# EAGLE design FT232-Breakout-v1 (EAGLE 6.4)
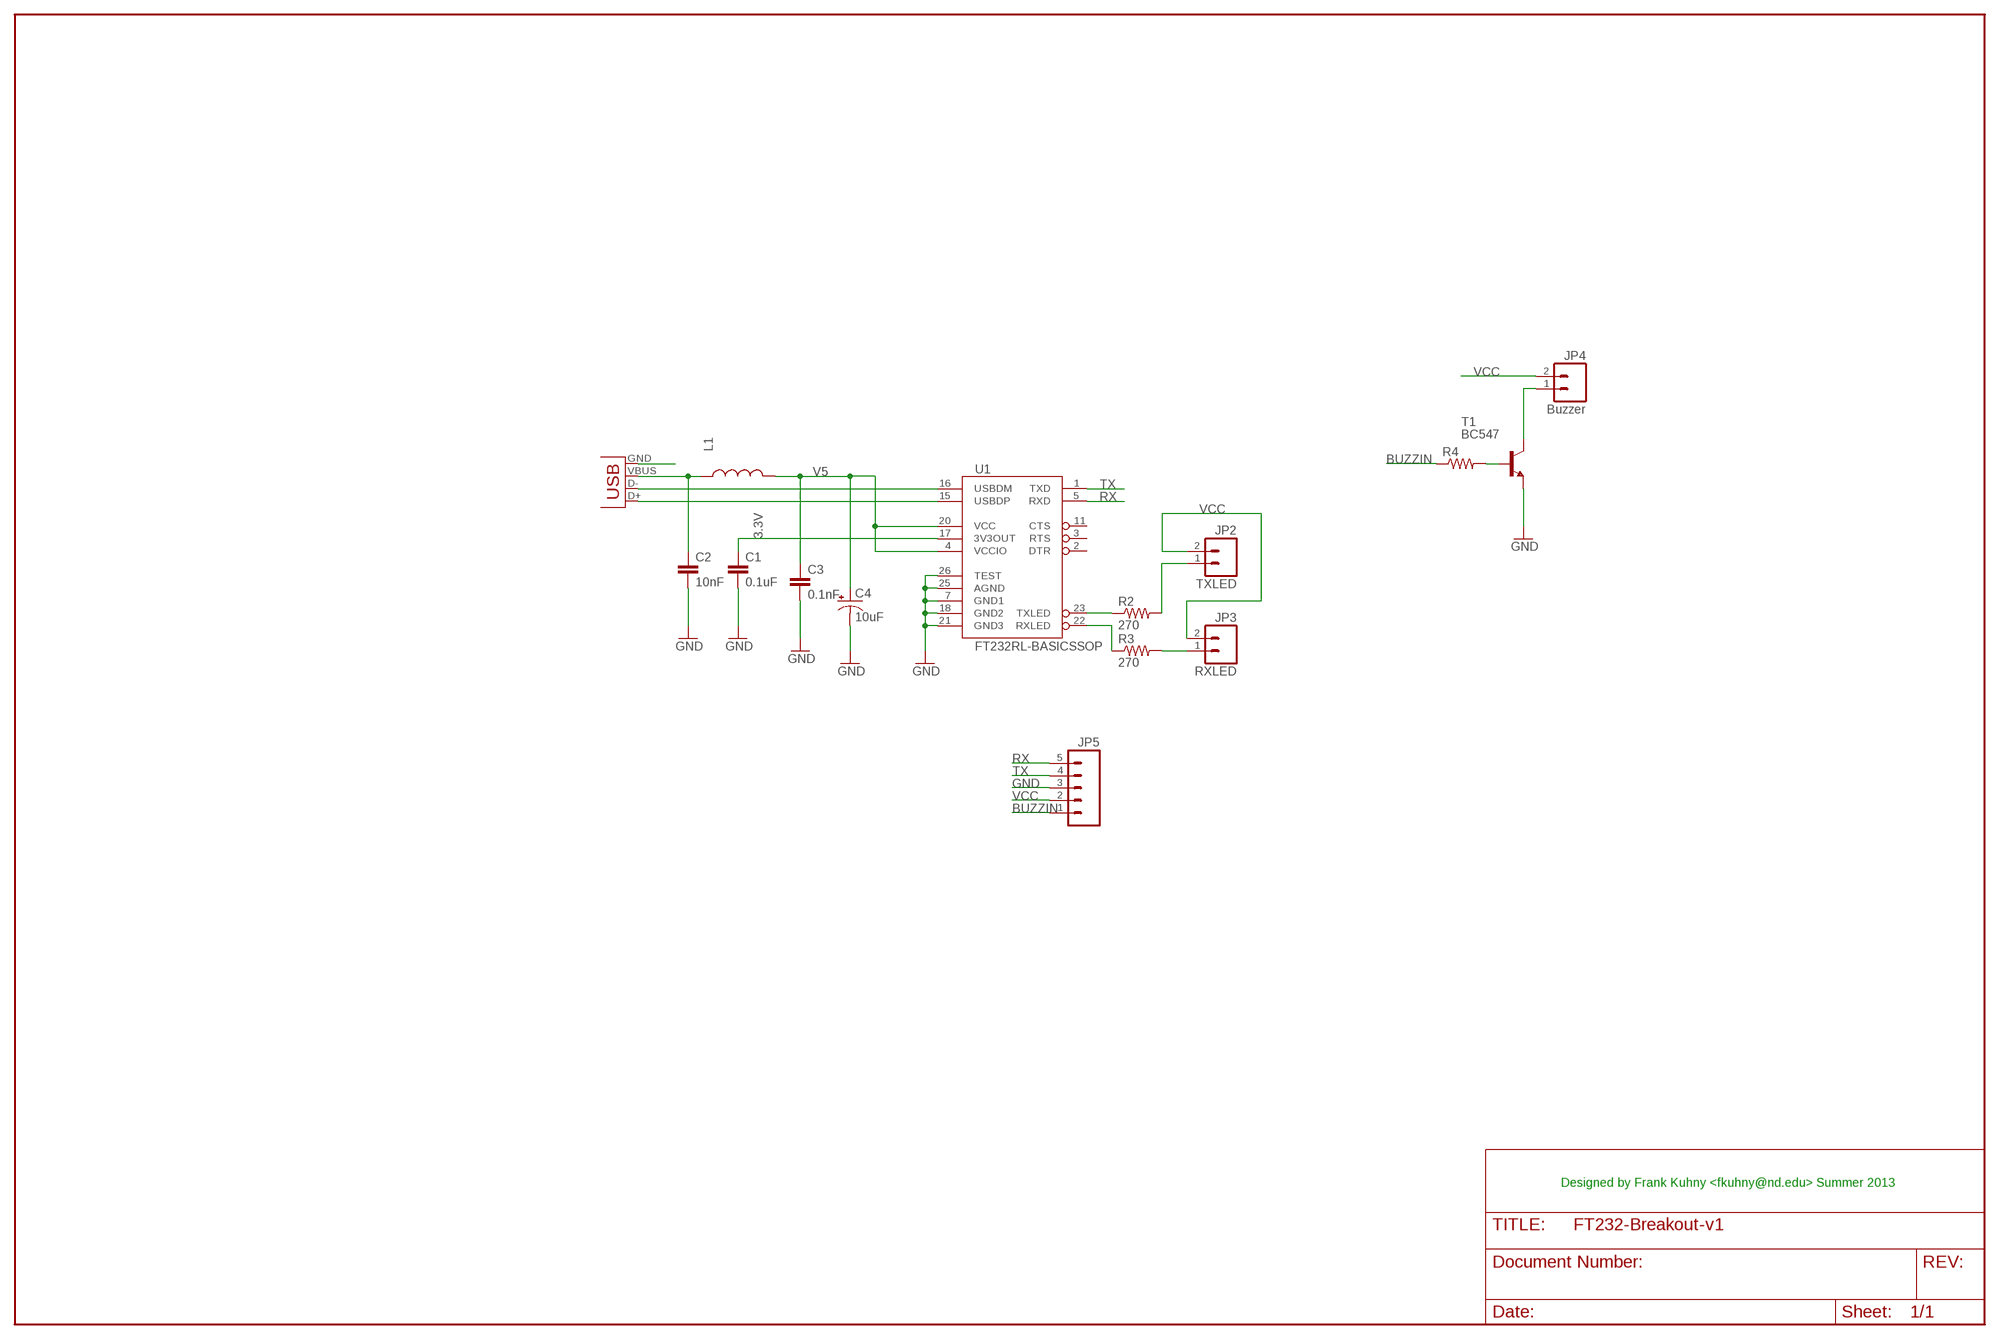
[diagram p0: schematic, sheet 1]

## Parts
C1  0.1uF  .22UF-CER  [0402-CAP]
C2  10nF  .22UF-CER  [0402-CAP]
C3  0.1nF  .22UF-CER  [0402-CAP]
C4  10uF  10UF-TANT  [EIA3216]
JP1  USB-B  USBPTH  [USB-B-PTH]
JP2  TXLED  M02LOCK  [1X02_LOCK]
JP3  RXLED  M02LOCK  [1X02_LOCK]
JP4  Buzzer  M02LOCK  [1X02_LOCK]
JP5  M05LOCK  [1X05_LOCK]
L1  INDUCTOR0603  [0603]
R2  270  RESISTORPTH-1/2W  [AXIAL-0.5]
R3  270  RESISTORPTH-1/2W  [AXIAL-0.5]
R4  RESISTORPTH-1/2W  [AXIAL-0.5]
T1  BC547  [TO92]
U1  FT232RL-BASICSSOP  [SSOP28DB]

## Nets
3.3V: C1.1 U1.17(3V3OUT)
BUZZIN: JP5.1 R4.P$1
GND: C1.2 C2.2 C3.2 C4.C(-) JP1.GND JP5.3 T1.1(E) U1.7(GND1) U1.18(GND2) U1.21(GND3) U1.25(AGND) U1.26(TEST)
N$1: C2.1 JP1.VBUS L1.1
N$2: R4.P$2 T1.2(B)
N$3: JP3.1 R3.P$2
N$4: JP1.D- U1.16(USBDM)
N$5: JP1.D+ U1.15(USBDP)
N$6: JP4.1 T1.3(C)
N$7: R3.P$1 U1.22(RXLED)
N$8: R2.P$1 U1.23(TXLED)
N$9: JP2.1 R2.P$2
RX: JP5.5 U1.5(RXD)
TX: JP5.4 U1.1(TXD)
V5: C3.1 C4.A(+) L1.2 U1.4(VCCIO) U1.20(VCC)
VCC: JP2.2 JP3.2 JP4.2 JP5.2
Unconnected: U1.2(DTR) U1.3(RTS) U1.11(CTS)

## Notes on the sheet
- Designed by Frank Kuhny <fkuhny@nd.edu> Summer 2013

## Library data of the parts
C1-C3 = SparkFun-Capacitors:.22UF-CER: .22uF ceramic SMT CAP-09885- 50V +80%/-20% (0603); PROD_ID: CAP-09885; VALUE: .22uF
C4 = SparkFun-Capacitors:10UF-TANT: 10uF Tantalum SMT CAP-00811- 16V 10% (EIA-3216); PROD_ID: CAP-00811
JP1 = SparkFun-Connectors:USB: USB Connectors USB-B-PTH is fully proven SKU : PRT-00139/CONN-08278 USB-miniB is fully proven SKU : PRT-00587 USB-A-PCB is untested. USB-A-H is throughly reviewed, but untested. Spark Fun Electronics SKU : PRT-00437 USB-B-SMT is throughly reviewed, but untested. Needs silkscreen touching up. USB-A-S has not been used/tested USB-MB-H has not been used/tested USB-MICROB has been used. CONN-09505; PROD_ID: CONN-08278
JP2-JP4 = SparkFun-Connectors:M02: Standard 2-pin 0.1" header. Use with - straight break away headers ( PRT-00116) - right angle break away headers (PRT-00553) - swiss pins (PRT-00743) - machine pins (PRT-00117) - female headers (PRT-00115) Molex polarized connector foot print use with: PRT-08233 with associated crimp pins and housings. 2.54_SCREWTERM for use with PRT-10571. 3.5mm Screw Terminal footprints for PRT-08084 5mm Screw Terminal footprints for use with PRT-08433
JP5 = SparkFun-Connectors:M05: Header 5 Standard 5-pin 0.1" header. Use with straight break away headers (SKU : PRT-00116), right angle break away headers (PRT-00553), swiss pins (PRT-00743), machine pins (PRT-00117), and female headers (PRT-00115). Molex polarized connector foot print use with SKU : PRT-08230 with associated crimp pins and housings.
L1 = SparkFun-Passives:INDUCTOR: Inductors Basic Inductor/Choke - 0603 and 1206. Footprints are not proven and vary greatly between part numbers. SRN6045- 33uH, 20% 1.4A
R2-R4 = SparkFun-Passives:RESISTOR: Resistor Basic schematic elements and footprints for 0603, 1206, and PTH resistors.
T1 = transistor:BC547: NPN TRANSISTOR
U1 = SparkFun-DigitalIC:FT232RL-BASIC: USB UART This is the simplified version of the FT232RL unit. Only what you need, nothing you don't. Spark Fun Electronics SKU : COM-00650

## Board
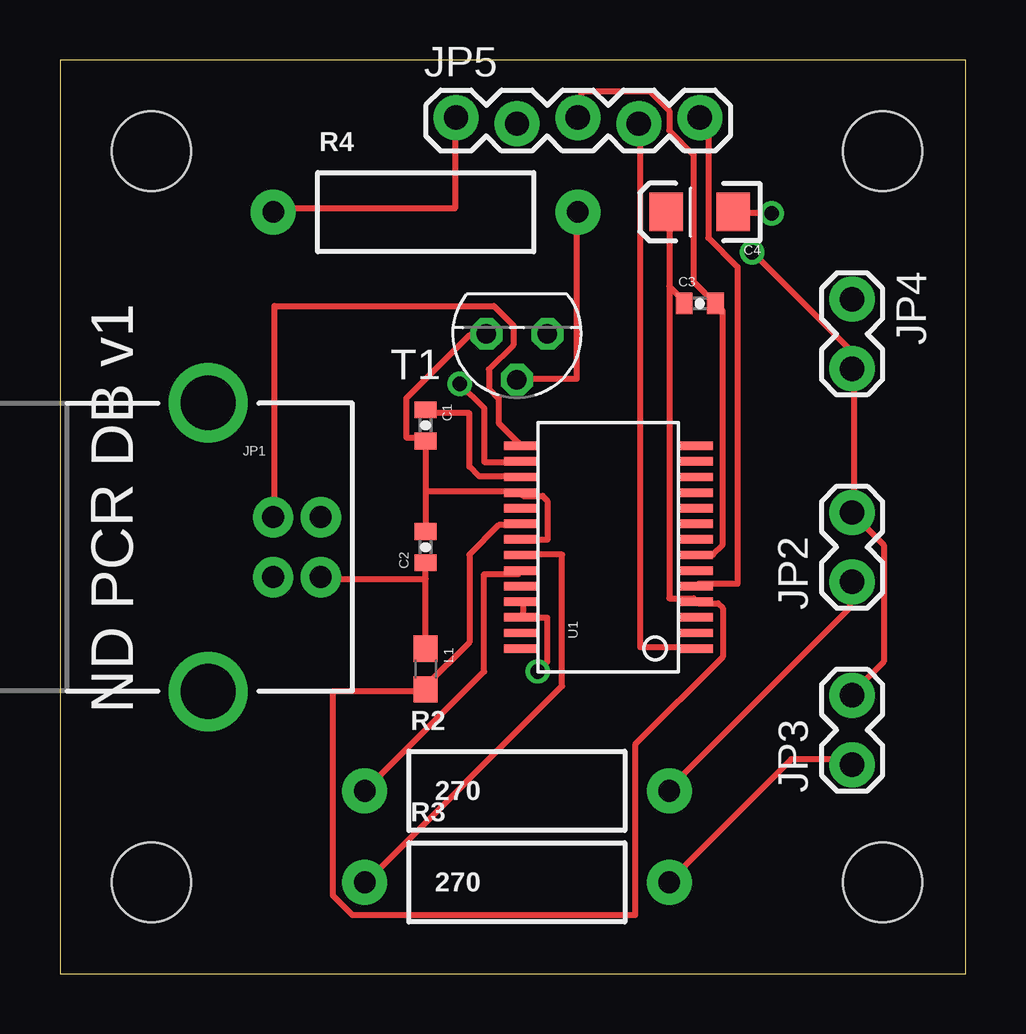
[diagram p1: board, top side]
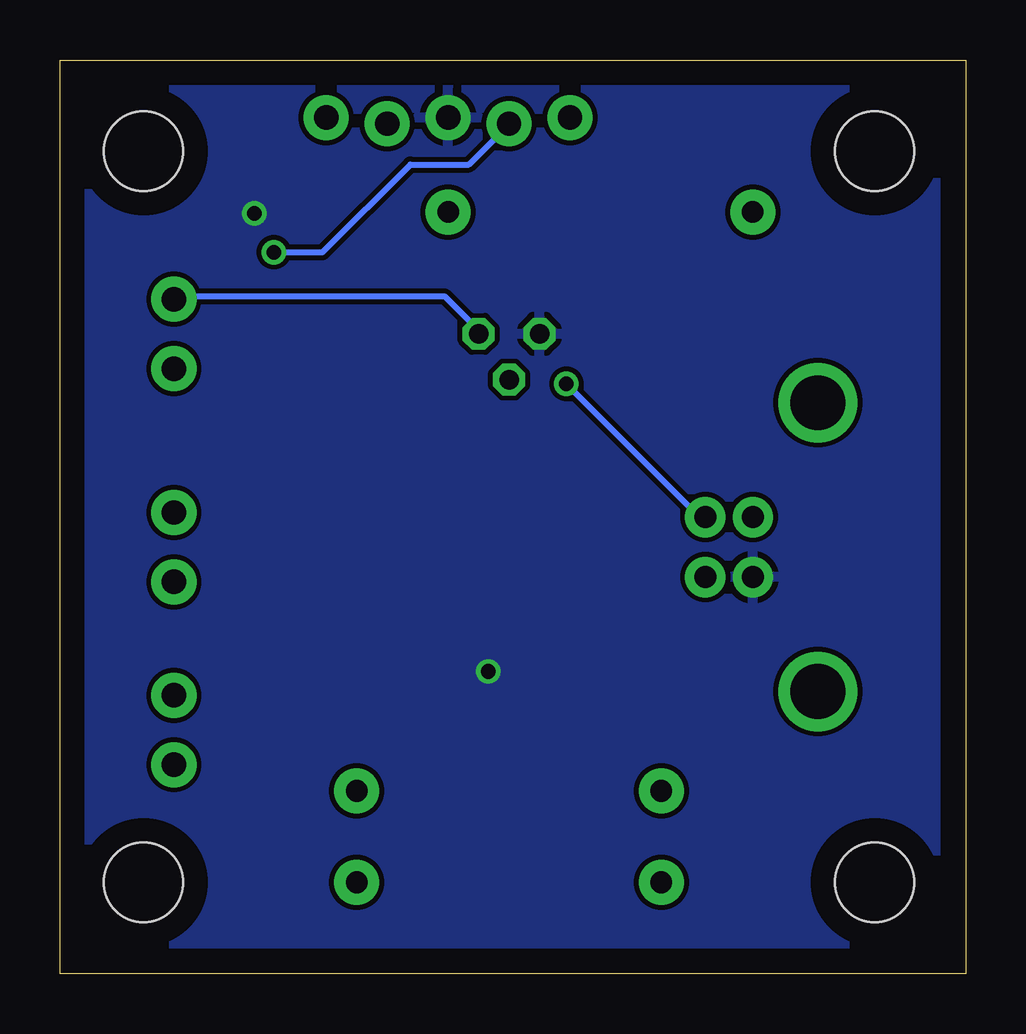
[diagram p2: board, bottom side, seen from below]

Size 37.77 x 38.09 mm. Coordinates in mm from the lower left corner, seen from the top.
Outline: 0,0 37.77,0 37.77,38.09 0,38.09 0,0
Copper layers (1*16): Top 0.035mm / dielectric 1.5mm / Bottom 0.035mm
Design rules "default": minimum track width 10mil, minimum drill 24mil, track to track 8mil, track to pad 8mil, pad to pad 8mil, via to via 8mil, smd to smd 8mil, copper to edge 40mil, drill to drill 8mil, minimum pad ring 10mil, minimum via ring 8mil, stop-mask expansion 4mil, vias tented up to drill 0mil, thermal gap 10mil

### Footprints (pad centres in the part's own frame; a part is rotated, then mirrored left to right if it is on the bottom)
0402-CAP = smd 0.7 x 0.9: 1 -0.65,0; 2 0.65,0
EIA3216 = smd 1.4 x 1.6: A 1.4,0; C -1.4,0
USB-B-PTH = drill 0.914 pad 1.676: D+ 0,1.25; D- 1.981,1.25; GND 0,-1.25; VBUS 1.981,-1.25 | drill 2.286: S1 -2.718,-6.02; S2 -2.718,6.02
1X02_LOCK = drill 1.016 pad 1.88: 1 -0.178,0; 2 2.718,0
1X05_LOCK = drill 1.016 pad 1.88: 1 0,0.127; 2 2.54,-0.127; 3 5.08,0.127; 4 7.62,-0.127; 5 10.16,0.127
0603 = smd 1.1 x 1: 1 -0.85,0; 2 0.85,0
AXIAL-0.5 = drill 0.9 pad 1.88: P$1 -6.35,0; P$2 6.35,0
TO92 = drill 0.813 octagon: 1 1.27,0; 2 0,1.905; 3 -1.27,0
SSOP28DB = smd 0.348 x 1.397: 1 -4.225,-3.656; 2 -3.575,-3.656; 3 -2.925,-3.656; 4 -2.275,-3.656; 5 -1.625,-3.656; 6 -0.975,-3.656; 7 -0.325,-3.656; 8 0.325,-3.656; 9 0.975,-3.656; 10 1.625,-3.656; 11 2.275,-3.656; 12 2.925,-3.656; 13 3.575,-3.656; 14 4.225,-3.656; 15 4.225,3.656; 16 3.575,3.656; 17 2.925,3.656; 18 2.275,3.656; 19 1.625,3.656; 20 0.975,3.656; 21 0.325,3.656; 22 -0.325,3.656; 23 -0.975,3.656; 24 -1.625,3.656; 25 -2.275,3.656; 26 -2.925,3.656; 27 -3.575,3.656; 28 -4.225,3.656
STAND-OFF = hole 3.302: 0,0

### Placement (x,y rotation side)
C1  15.24,22.86 270 top
C2  15.24,17.78 90 top
C3  26.67,27.94 0 top
C4  26.67,31.75 180 top
JP1  8.89,17.78 0 top
JP2  33.02,16.51 90 top
JP3  33.02,8.89 90 top
JP4  33.02,27.94 270 top
JP5  16.51,35.56 0 top
L1  15.24,12.7 270 top
R2  19.05,7.62 0 top
R3  19.05,3.81 0 top
R4  15.24,31.75 0 top
T1  19.05,26.67 180 top
U1  22.86,17.78 90 top
U$1  [STAND-OFF]  34.29,3.81 0 top
U$2  [STAND-OFF]  34.29,34.29 0 top
U$3  [STAND-OFF]  3.81,34.29 0 top
U$4  [STAND-OFF]  3.81,3.81 0 top

### Tracks (layer width: path | path; a pad name or v marks a point on that pad's centre or on a via)
3.3V
  Top 0.254: C1.1 15.24,23.37 17.07,23.37 17.07,21.13 17.48,20.73 19.1,20.73 U1.17
BUZZIN
  Top 0.254: R4.P$1 8.94,31.9 16.46,31.9 16.46,35.56 JP5.1
GND  (via drill 0.61)
  Top 0.254: U1.7 26.62,17.48 27.23,17.48 27.64,17.88 27.64,27.64 27.43,27.84 C3.2 27.23,28.04 26.42,28.85 26.42,34.14 25.4,35.15 25.4,35.97 24.59,36.78 21.74,36.78 21.74,35.76 JP5.3 | U1.21 19.3,18.09 20.32,18.09 20.32,19.71 20.12,19.91 19.3,19.91 U1.18 19.1,20.12 15.24,20.12 | 15.24,20.12 C1.2 15.24,22.35 14.43,22.35 14.43,23.98 17.07,26.62 17.68,26.62 T1.1 | 15.24,20.12 C2.2 | 19.3,14.83 19.3,15.44 U1.25 | v29.67,31.7 28.25,31.7 C4.C | 19.3,14.83 20.32,14.83 20.32,13.01 v19.91,12.6 | 19.3,14.83 U1.26
  pour Bottom: 1.27,36.83 36.83,36.83 36.83,1.27 1.27,1.27
N$1
  Top 0.254: L1.1 15.24,16.46 | 15.24,16.46 C2.1 | 15.24,16.46 10.97,16.46 JP1.VBUS
N$2
  Top 0.254: T1.2 19.1,24.79 21.54,24.79 21.54,31.7 R4.P$2
N$3
  Top 0.254: R3.P$2 25.4,3.86 30.48,8.94 32.92,8.94 32.92,8.74 JP3.1
N$4  (via drill 0.61)
  Top 0.254: v16.66,24.59 17.68,23.57 17.68,21.34 19.1,21.34 U1.16
  Bottom 0.254: v16.66,24.59 11.18,19.1 10.97,19.1 JP1.D-
N$5
  Top 0.254: U1.15 19.1,22.15 18.29,22.96 18.29,23.98 17.88,24.38 17.88,25.2 18.9,26.21 18.9,27.03 18.09,27.84 8.94,27.84 8.94,19.1 JP1.D+
N$6
  Bottom 0.254: T1.3 20.32,26.82 21.74,28.25 32.92,28.25 JP4.1
N$7
  Top 0.254: U1.22 19.3,17.48 20.93,17.48 20.93,11.99 12.8,3.86 R3.P$1
N$8
  Top 0.254: R2.P$1 17.68,12.6 17.68,16.66 19.1,16.66 U1.23
N$9
  Top 0.254: R2.P$2 25.4,7.72 32.92,15.24 32.92,16.26 JP2.1
RX
  Top 0.254: U1.5 26.62,16.26 28.25,16.26 28.25,29.46 27.03,30.68 27.03,35.36 26.82,35.56 JP5.5
TX
  Top 0.254: U1.1 26.42,13.61 24.18,13.61 24.18,35.36 JP5.4
V5
  Top 0.254: U1.20 19.1,18.69 18.29,18.69 17.07,17.48 17.07,13.82 15.24,11.99 L1.2 15.24,11.79 11.38,11.79 11.38,3.25 12.19,2.44 23.98,2.44 23.98,9.55 27.64,13.21 27.64,15.24 27.43,15.44 26.62,15.44 U1.4 26.42,15.65 25.4,15.65 25.4,28.65 | 25.4,28.65 26.01,28.04 C3.1 | 25.4,28.65 25.4,31.7 C4.A
VCC  (via drill 0.61)
  Top 0.254: JP3.2 33.12,11.79 34.34,13.01 34.34,17.88 33.12,19.1 JP2.2 33.12,19.3 33.12,25.2 JP4.2 32.92,25.4 32.92,26.01 v28.85,30.07
  Bottom 0.254: v28.85,30.07 26.82,30.07 23.16,33.73 20.73,33.73 19.1,35.36 JP5.2

### Text on the board
tPlace: ND PCR DB v1